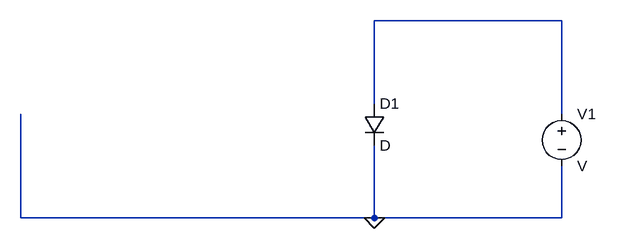
[diagram p0: schematic Draft2.asc]
Draft2.asc, the LTspice schematic file:
Version 4.1
SHEET 1 880 680
WIRE 224 -512 -64 -512
WIRE -64 -384 -64 -512
WIRE 224 -368 224 -512
WIRE -608 -208 -608 -368
WIRE -64 -208 -64 -320
WIRE -64 -208 -608 -208
WIRE 224 -208 224 -288
WIRE 224 -208 -64 -208
FLAG -64 -208 0
SYMBOL diode -80 -384 R0
SYMATTR InstName D1
SYMBOL voltage 224 -384 R0
SYMATTR InstName V1

The netlist it stands for:
* Draft2.asc
D1 N001 0 D
V1 N001 0 V
.model D D
.lib standard.dio
.backanno
.end